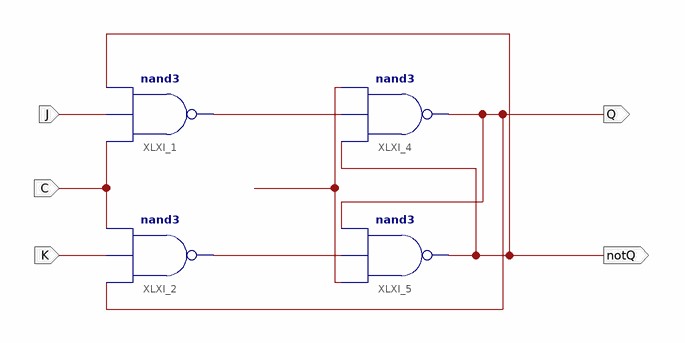
[diagram p0: schematic sheet 1]
// Xilinx ISE schematic scheme_pt1.sch (virtex5) as structural Verilog: 4 symbols, 5 ports
module scheme_pt1 (
  input  C,
  input  J,
  input  K,
  output notQ,
  output Q
);

  wire XLXN_1, XLXN_2, XLXN_7;

  nand XLXI_1 (XLXN_1, C, J, notQ);
  nand XLXI_2 (XLXN_2, Q, K, C);
  nand XLXI_4 (Q, notQ, XLXN_1, XLXN_7);
  nand XLXI_5 (notQ, XLXN_7, XLXN_2, Q);
endmodule
